# Altium schematic sheet Power Budget.SchDoc
size A4; SheetNumber: 2; SheetTotal: 10
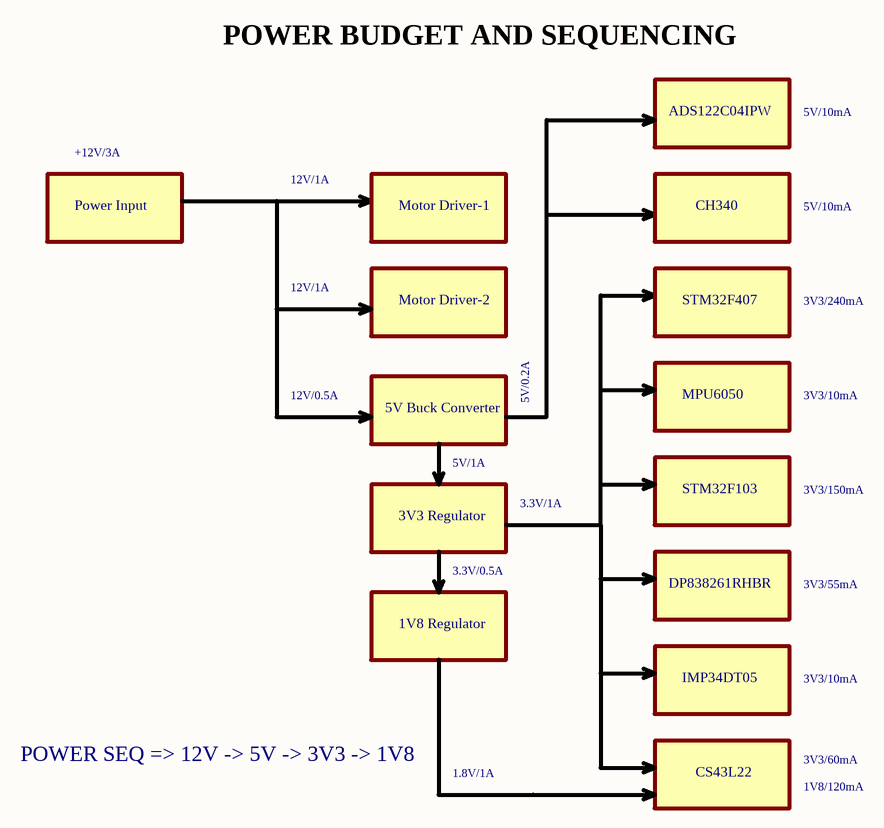
[diagram p0: Power Budget.SchDoc]

## Notes on the sheet
- POWER BUDGET AND SEQUENCING
- ADS122C04IPW
- 5V/10mA
- +12V/3A
- 12V/1A
- Power Input
- Motor Driver-1
- CH340
- Motor Driver-2
- STM32F407
- 3V3/240mA
- 12V/0.5A
- 5V/0.2A
- MPU6050
- 3V3/10mA
- 5V Buck Converter
- 5V/1A
- 3V3 Regulator
- 3.3V/1A
- STM32F103
- 3V3/150mA
- 3.3V/0.5A
- DP838261RHBR
- 3V3/55mA
- 1V8 Regulator
- IMP34DT05
- POWER SEQ => 12V -> 5V -> 3V3 -> 1V8
- 1.8V/1A
- CS43L22
- 3V3/60mA
- 1V8/120mA
- Title:
- Document Name :
- Project Code :
- Sheet
- of
- Author :